# Altium schematic sheet IO_Block.SchDoc
size A4; SheetNumber: 9; SheetTotal: 9
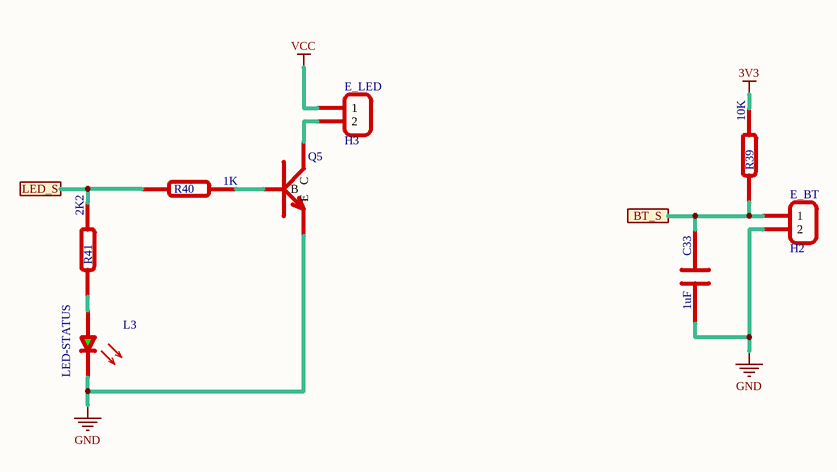
[diagram p0: IO_Block.SchDoc]

## Parts
C33  1uF  [C0603]
H2  E_BT  [XH-2.54-2P]
H3  E_LED  [XH-2.54-2P]
L3  LED-STATUS  [LED-0805-GREEN]
Q5  S8050  [TO-92A]  (value not drawn)
R39  10K  [R0603]
R40  1K  [R0603]
R41  2K2  [R0603]

## Ports
BT_S, LED_S

## Nets
3V3: R39.2
GND: C33.1 H2.2 L3.2(K) Q5.2(E)
VCC: H3.1
BT_S: C33.2 H2.1 R39.1 ; port BT_S
LED_S: R40.1 R41.2 ; port LED_S
NetH3_2: H3.2 Q5.3(C)
NetL3_1: L3.1(A) R41.1
NetQ5_1: Q5.1(B) R40.2

## Notes on the sheet
- Title
- Size:
- Date:
- A4
- Number:
- Time:
- Revision:
- Design by:
- Company:
- File:

## Library data of the parts
C33 = CAP-CER: Ceramic Capacitor
H2 H3 = CONN-2P: Connector 2 Pole
L3 = LED-Green: Green Light Emiter Diode
Q5 = S8050: NPN Transistors 0.5A Collector to Emitter 25V
R39-R41 = Resistor